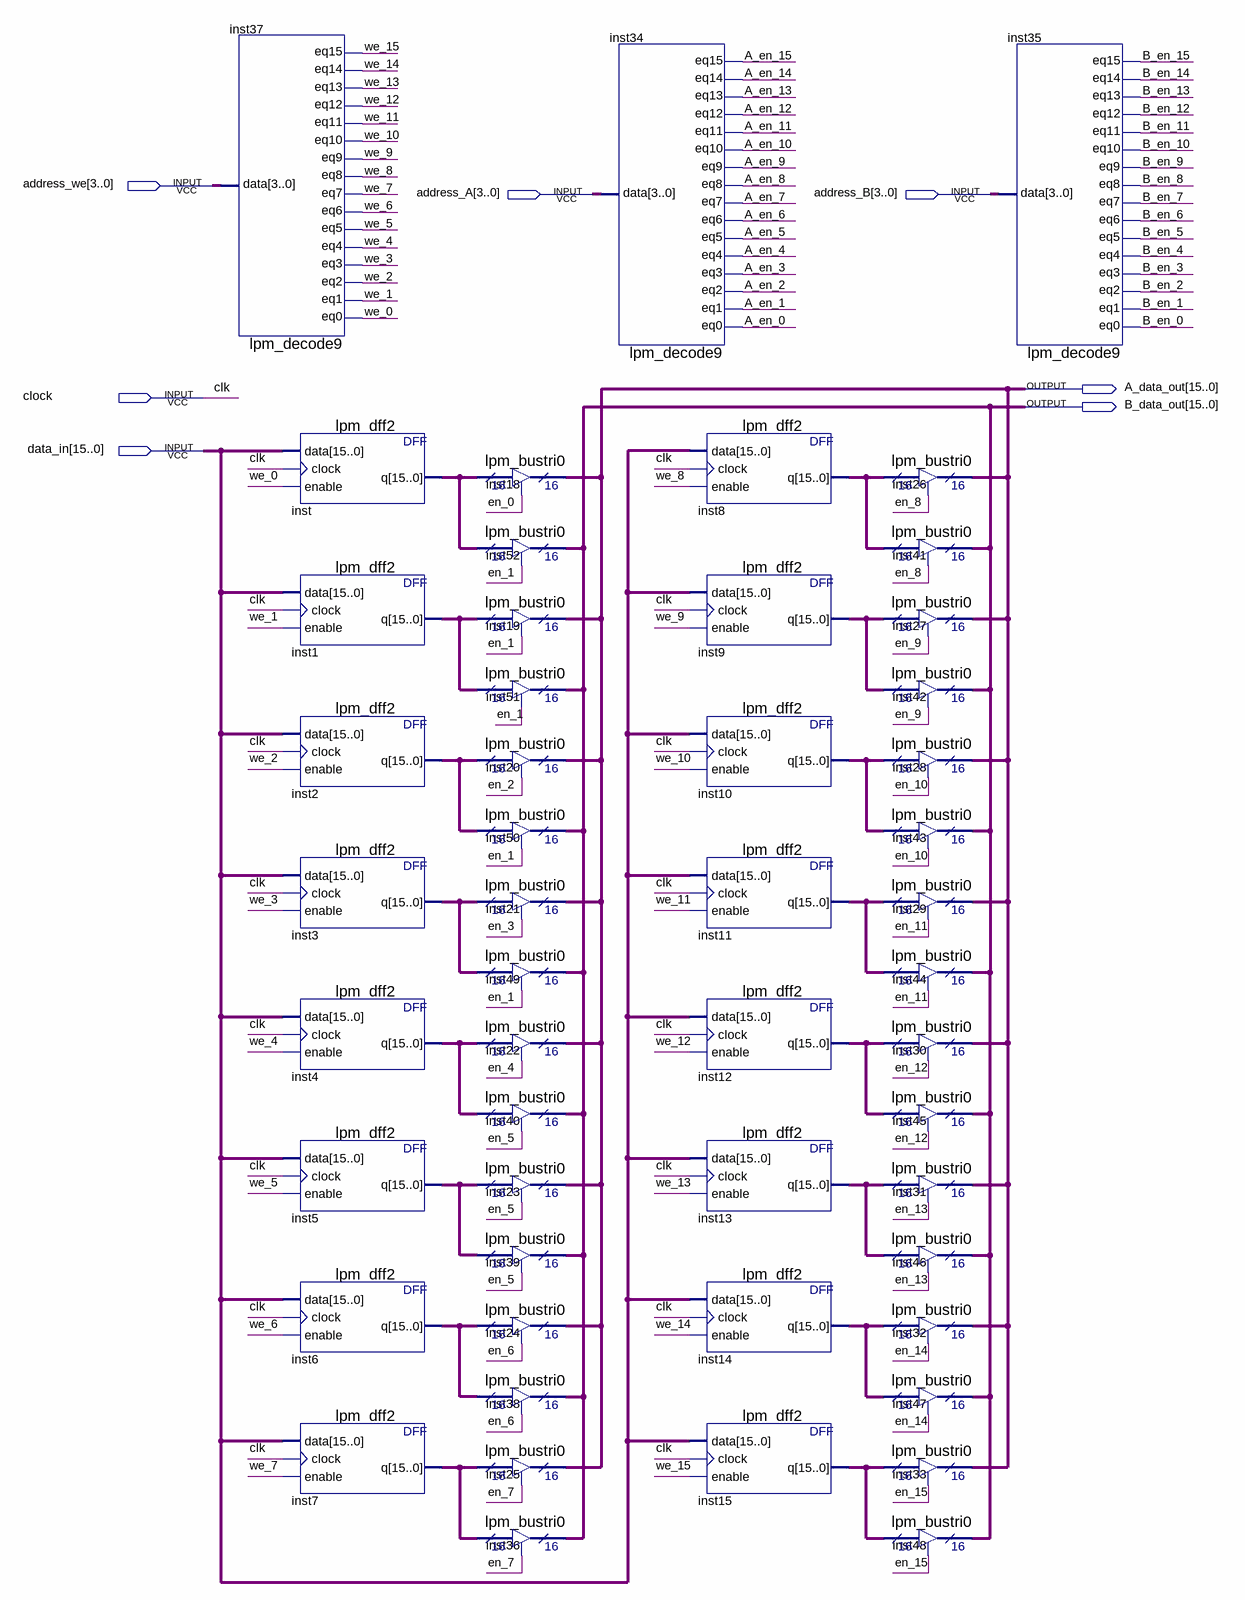
[diagram p0: schematic sheet]
// Quartus schematic register_unit.bdf as structural Verilog: 51 symbols, 7 pins
module register_unit (
  input  [3:0] address_we,
  input  [3:0] address_A,
  input  [3:0] address_B,
  input  clock,
  input  [15:0] data_in,
  output [15:0] A_data_out,
  output [15:0] B_data_out
);

  wire A_en_0, A_en_1, A_en_2, A_en_3, A_en_4, A_en_5, A_en_6, A_en_7, A_en_8, A_en_9, A_en_10, A_en_11,
       A_en_12, A_en_13, A_en_14, A_en_15, B_en_0, B_en_1, B_en_2, B_en_3, B_en_4, B_en_5, B_en_6, B_en_7,
       B_en_8, B_en_9, B_en_10, B_en_11, B_en_12, B_en_13, B_en_14, B_en_15, en_0, en_1, en_2, en_3, en_4,
       en_5, en_6, en_7, en_8, en_9, en_10, en_11, en_12, en_13, en_14, en_15, we_0, we_1, we_2, we_3, we_4,
       we_5, we_6, we_7, we_8, we_9, we_10, we_11, we_12, we_13, we_14, we_15;
  wire [15:0] inst1_q, inst2_q, inst3_q, inst4_q, inst5_q, inst6_q, inst7_q, inst8_q, inst9_q, inst10_q,
       inst11_q, inst12_q, inst13_q, inst14_q, inst15_q, inst_q;

  lpm_decode9 inst37 (
    .data(address_we), .eq0(we_0), .eq1(we_1), .eq2(we_2), .eq3(we_3), .eq4(we_4), .eq5(we_5), .eq6(we_6),
    .eq7(we_7), .eq8(we_8), .eq9(we_9), .eq10(we_10), .eq11(we_11), .eq12(we_12), .eq13(we_13), .eq14(we_14),
    .eq15(we_15));
  lpm_dff2 inst (.data(data_in), .clock(clock), .enable(we_0), .q(inst_q));
  lpm_dff2 inst1 (.data(data_in), .clock(clock), .enable(we_1), .q(inst1_q));
  lpm_dff2 inst2 (.data(data_in), .clock(clock), .enable(we_2), .q(inst2_q));
  lpm_dff2 inst3 (.data(data_in), .clock(clock), .enable(we_3), .q(inst3_q));
  lpm_dff2 inst4 (.data(data_in), .clock(clock), .enable(we_4), .q(inst4_q));
  lpm_dff2 inst5 (.data(data_in), .clock(clock), .enable(we_5), .q(inst5_q));
  lpm_dff2 inst6 (.data(data_in), .clock(clock), .enable(we_6), .q(inst6_q));
  lpm_dff2 inst7 (.data(data_in), .clock(clock), .enable(we_7), .q(inst7_q));
  lpm_bustri0 inst18 (.enabledt(en_0), .data(inst_q), .tridata(A_data_out));
  lpm_bustri0 inst52 (.enabledt(en_1), .data(inst_q), .tridata(B_data_out));
  lpm_bustri0 inst19 (.enabledt(en_1), .data(inst1_q), .tridata(A_data_out));
  lpm_bustri0 inst51 (.enabledt(en_1), .data(inst1_q), .tridata(B_data_out));
  lpm_bustri0 inst20 (.enabledt(en_2), .data(inst2_q), .tridata(A_data_out));
  lpm_bustri0 inst50 (.enabledt(en_1), .data(inst2_q), .tridata(B_data_out));
  lpm_bustri0 inst21 (.enabledt(en_3), .data(inst3_q), .tridata(A_data_out));
  lpm_bustri0 inst49 (.enabledt(en_1), .data(inst3_q), .tridata(B_data_out));
  lpm_bustri0 inst22 (.enabledt(en_4), .data(inst4_q), .tridata(A_data_out));
  lpm_bustri0 inst40 (.enabledt(en_5), .data(inst4_q), .tridata(B_data_out));
  lpm_bustri0 inst23 (.enabledt(en_5), .data(inst5_q), .tridata(A_data_out));
  lpm_bustri0 inst39 (.enabledt(en_5), .data(inst5_q), .tridata(B_data_out));
  lpm_bustri0 inst24 (.enabledt(en_6), .data(inst6_q), .tridata(A_data_out));
  lpm_bustri0 inst38 (.enabledt(en_6), .data(inst6_q), .tridata(B_data_out));
  lpm_bustri0 inst25 (.enabledt(en_7), .data(inst7_q), .tridata(A_data_out));
  lpm_bustri0 inst36 (.enabledt(en_7), .data(inst7_q), .tridata(B_data_out));
  lpm_decode9 inst34 (
    .data(address_A), .eq0(A_en_0), .eq1(A_en_1), .eq2(A_en_2), .eq3(A_en_3), .eq4(A_en_4), .eq5(A_en_5),
    .eq6(A_en_6), .eq7(A_en_7), .eq8(A_en_8), .eq9(A_en_9), .eq10(A_en_10), .eq11(A_en_11), .eq12(A_en_12),
    .eq13(A_en_13), .eq14(A_en_14), .eq15(A_en_15));
  lpm_dff2 inst8 (.data(data_in), .clock(clock), .enable(we_8), .q(inst8_q));
  lpm_dff2 inst9 (.data(data_in), .clock(clock), .enable(we_9), .q(inst9_q));
  lpm_dff2 inst10 (.data(data_in), .clock(clock), .enable(we_10), .q(inst10_q));
  lpm_dff2 inst11 (.data(data_in), .clock(clock), .enable(we_11), .q(inst11_q));
  lpm_dff2 inst12 (.data(data_in), .clock(clock), .enable(we_12), .q(inst12_q));
  lpm_dff2 inst13 (.data(data_in), .clock(clock), .enable(we_13), .q(inst13_q));
  lpm_dff2 inst14 (.data(data_in), .clock(clock), .enable(we_14), .q(inst14_q));
  lpm_dff2 inst15 (.data(data_in), .clock(clock), .enable(we_15), .q(inst15_q));
  lpm_bustri0 inst26 (.enabledt(en_8), .data(inst8_q), .tridata(A_data_out));
  lpm_bustri0 inst41 (.enabledt(en_8), .data(inst8_q), .tridata(B_data_out));
  lpm_bustri0 inst27 (.enabledt(en_9), .data(inst9_q), .tridata(A_data_out));
  lpm_bustri0 inst42 (.enabledt(en_9), .data(inst9_q), .tridata(B_data_out));
  lpm_bustri0 inst28 (.enabledt(en_10), .data(inst10_q), .tridata(A_data_out));
  lpm_bustri0 inst43 (.enabledt(en_10), .data(inst10_q), .tridata(B_data_out));
  lpm_bustri0 inst29 (.enabledt(en_11), .data(inst11_q), .tridata(A_data_out));
  lpm_bustri0 inst44 (.enabledt(en_11), .data(inst11_q), .tridata(B_data_out));
  lpm_bustri0 inst30 (.enabledt(en_12), .data(inst12_q), .tridata(A_data_out));
  lpm_bustri0 inst45 (.enabledt(en_12), .data(inst12_q), .tridata(B_data_out));
  lpm_bustri0 inst31 (.enabledt(en_13), .data(inst13_q), .tridata(A_data_out));
  lpm_bustri0 inst46 (.enabledt(en_13), .data(inst13_q), .tridata(B_data_out));
  lpm_bustri0 inst32 (.enabledt(en_14), .data(inst14_q), .tridata(A_data_out));
  lpm_bustri0 inst47 (.enabledt(en_14), .data(inst14_q), .tridata(B_data_out));
  lpm_bustri0 inst33 (.enabledt(en_15), .data(inst15_q), .tridata(A_data_out));
  lpm_bustri0 inst48 (.enabledt(en_15), .data(inst15_q), .tridata(B_data_out));
  lpm_decode9 inst35 (
    .data(address_B), .eq0(B_en_0), .eq1(B_en_1), .eq2(B_en_2), .eq3(B_en_3), .eq4(B_en_4), .eq5(B_en_5),
    .eq6(B_en_6), .eq7(B_en_7), .eq8(B_en_8), .eq9(B_en_9), .eq10(B_en_10), .eq11(B_en_11), .eq12(B_en_12),
    .eq13(B_en_13), .eq14(B_en_14), .eq15(B_en_15));

  // Other names for the same wires on the sheet: clk = clock
endmodule
